# EAGLE design 2019 (EAGLE 9.4.2)

## Sheet 1 of 2
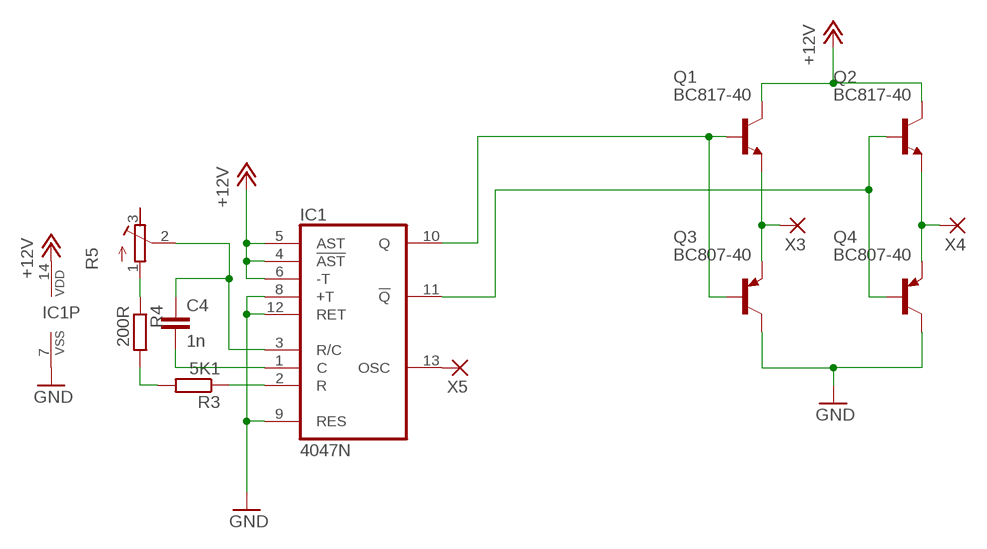
[diagram p0: schematic, sheet 1]

### Parts
C4  1n  CAP_0805  [CAP0805]
IC1  4047N  [DIL14]
Q1  BC817-40  TRANS-NPNSOT-23  [SOT95P240X115-3]
Q2  BC817-40  TRANS-NPNSOT-23  [SOT95P240X115-3]
Q3  BC807-40  TRANS-PNPSOT-23  [SOT95P240X115-3]
Q4  BC807-40  TRANS-PNPSOT-23  [SOT95P240X115-3]
R3  5K1  R_R0805  [RESC2012X50]
R4  200R  R_R0805  [RESC2012X50]
R5  R_POT3296X  [POT-3296X]
X3  WIREPAD-SMD2  [PAD-1.27X2.54]
X4  WIREPAD-SMD2  [PAD-1.27X2.54]
X5  WIREPAD-SMD2  [PAD-1.27X2.54]

### Nets
+12V: IC1.4(!AST) IC1.5(AST) IC1.6(-T) IC1.14(VDD) Q1.3(C) Q2.3(C) ; also sheet 2
GND: IC1.7(VSS) IC1.8(+T) IC1.9(RES) IC1.12(RET) Q3.3(C) Q4.3(C) ; also sheet 2
N$5: C4.1 IC1.3(R/C) R5.2(S)
N$6: C4.2 IC1.1(C)
N$7: IC1.2(R) R3.1
N$8: R3.2 R4.2
N$9: R4.1 R5.1(A)
N$10: IC1.10(Q) Q1.1(B) Q3.1(B)
N$11: IC1.11(!Q) Q2.1(B) Q4.1(B)
N$14: Q1.2(E) Q3.2(E) X3.P$1(P)
N$15: Q2.2(E) Q4.2(E) X4.P$1(P)
N$16: IC1.13(OSC) X5.P$1(P)
Unconnected: R5.3(E)

## Sheet 2 of 2
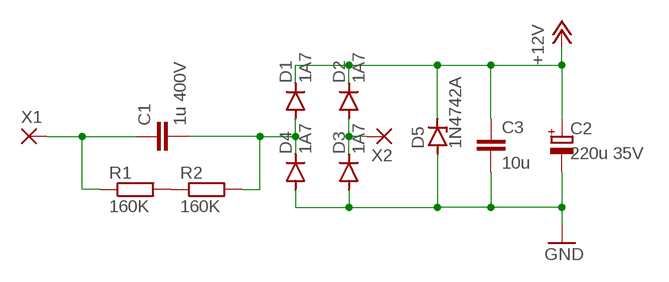
[diagram p1: schematic, sheet 2]

### Parts
C1  1u 400V  C-EU225-108X268  [C225-108X268]
C2  220u 35V  CAP-POL_E2.5-7  [E2,5-7]
C3  10u  CAP_1210  [CAP1210]
D1  1A7  DIODE-D-5  [D-5]
D2  1A7  DIODE-D-5  [D-5]
D3  1A7  DIODE-D-5  [D-5]
D4  1A7  DIODE-D-5  [D-5]
D5  1N4742A  ZENER-DIODEDO41Z10  [DO41Z10]
R1  160K  R_MF-0125  [MF-0125]
R2  160K  R_MF-0125  [MF-0125]
X1  WIREPAD-SMD2  [PAD-1.27X2.54]
X2  WIREPAD-SMD2  [PAD-1.27X2.54]

### Nets
+12V: C2.+ C3.1 D1.C D2.C D5.C ; also sheet 1
GND: C2.- C3.2 D3.A D4.A D5.A ; also sheet 1
N$1: C1.1 R1.1 X1.P$1(P)
N$2: R1.2 R2.1
N$3: C1.2 D1.A D4.C R2.2
N$4: D2.A D3.C X2.P$1(P)

## Library data of the parts
C1 = rcl:C-EU: CAPACITOR, European symbol; SPICEPREFIX: C
C2 = Flamberm:CAP-POL_
C3 C4 = Flamberm:CAP_
D1-D4 = diode:DIODE-: DIODE
D5 = diode:ZENER-DIODE: Z-Diode
IC1 = 40xx:4047: LP monostable/astable MULTIVIBRATOR
Q1 Q2 = Flamberm:TRANS-NPN
Q3 Q4 = Flamberm:TRANS-PNP
R1-R4 = Flamberm:R_
R5 = Flamberm:R_POT
X1-X5 = Flamberm:WIREPAD-SMD2: SMD PAD

## Board
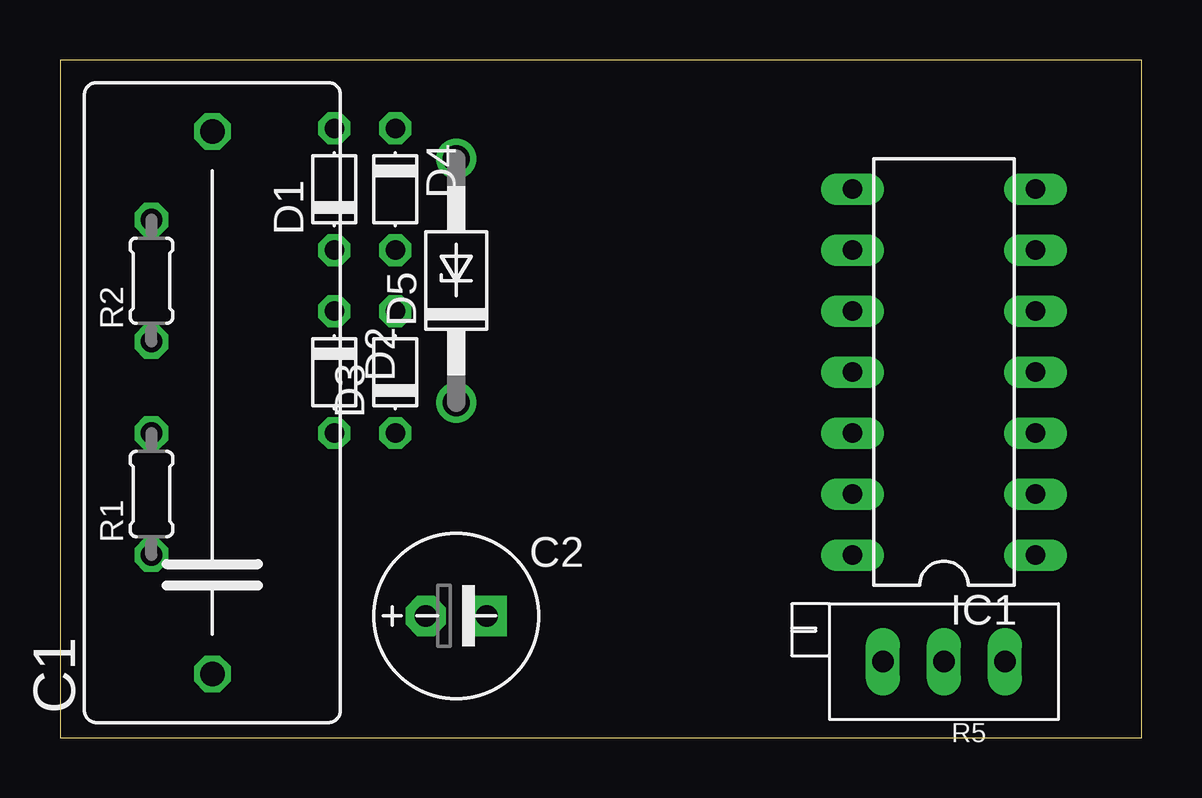
[diagram p2: board, top side]
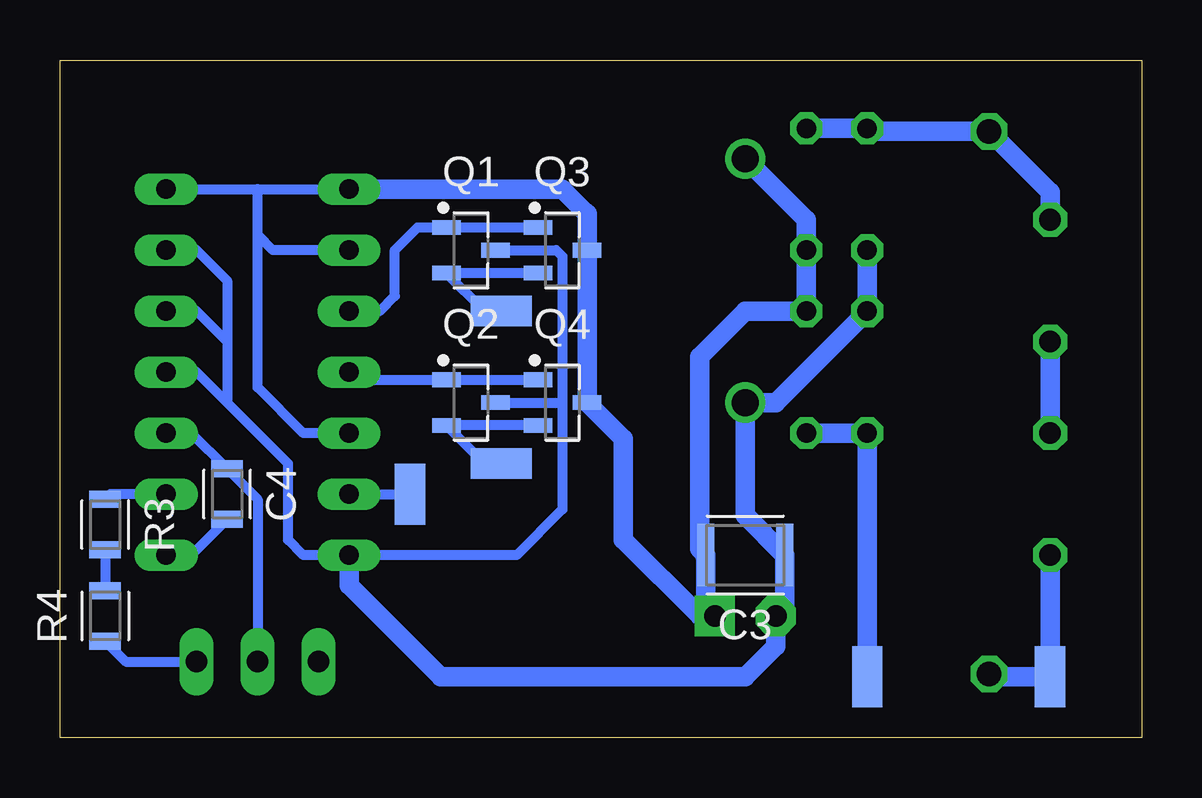
[diagram p3: board, bottom side, seen from below]

Size 45.06 x 28.25 mm. Coordinates in mm from the lower left corner, seen from the top.
Outline: 0,0 45.06,0 45.06,28.25 0,28.25 0,0
Copper layers (1*16): Top 0.035mm / dielectric 1.5mm / Bottom 0.035mm
Design rules "default": minimum track width 6mil, minimum drill 0.35mm, track to track 6mil, track to pad 6mil, pad to pad 6mil, via to via 6mil, smd to smd 6mil, copper to edge 40mil, drill to drill 6mil, minimum pad ring 10mil, minimum via ring 8mil, stop-mask expansion 4mil, vias tented up to drill 0mil, thermal gap 10mil

### Footprints (pad centres in the part's own frame; a part is rotated, then mirrored left to right if it is on the bottom)
C225-108X268 = drill 1.016 octagon: 1 -11.303,0; 2 11.303,0
E2,5-7 = drill 0.9 pad 1.676 octagon: + -1.27,0 | drill 0.9 pad 1.676 square: - 1.27,0
CAP1210 = smd 0.712 x 2.612: 1 -1.65,0; 2 1.65,0
CAP0805 = smd 0.712 x 1.312: 1 -1.05,0; 2 1.05,0
D-5 = drill 0.813 octagon: A 2.54,0; C -2.54,0
DO41Z10 = drill 1.118: A 5.08,0; C -5.08,0
DIL14 = drill 0.813 long: 1 -7.62,-3.81; 2 -5.08,-3.81; 3 -2.54,-3.81; 4 0,-3.81; 5 2.54,-3.81; 6 5.08,-3.81; 7 7.62,-3.81; 8 7.62,3.81; 9 5.08,3.81; 10 2.54,3.81; 11 0,3.81; 12 -2.54,3.81; 13 -5.08,3.81; 14 -7.62,3.81
SOT95P240X115-3 = smd 1.18 x 0.609: 1 -1.024,0.95; 2 -1.024,-0.95; 3 1.024,0
MF-0125 = drill 0.9 octagon: 1 -2.54,0; 2 2.54,0
RESC2012X50 = smd 0.712 x 1.312: 1 -1.05,0; 2 1.05,0
POT-3296X = drill 0.9 long: 1 0,-2.54; 2 0,0; 3 0,2.54
PAD-1.27X2.54 = smd 2.54 x 1.27: P$1 0,0

### Placement (x,y rotation side)
C1  6.35,13.97 90 top
C2  16.51,5.08 0 top
C3  16.51,7.62 180 bottom
C4  38.1,10.16 270 bottom
D1  11.43,22.86 90 top
D2  11.43,15.24 270 top
D3  13.97,15.24 90 top
D4  13.97,22.86 270 top
D5  16.51,19.05 90 top
IC1  36.83,15.24 90 top
Q1  27.94,20.32 0 bottom
Q2  27.94,13.97 0 bottom
Q3  24.13,20.32 0 bottom
Q4  24.13,13.97 0 bottom
R1  3.81,10.16 90 top
R2  3.81,19.05 90 top
R3  43.18,8.89 270 bottom
R4  43.18,5.08 90 bottom
R5  36.83,3.17 90 top
X1  3.81,2.54 270 bottom
X2  11.43,2.54 90 bottom
X3  26.67,17.78 0 bottom
X4  26.67,11.43 0 bottom
X5  30.48,10.16 90 bottom

### Tracks (layer width: path | path; a pad name or v marks a point on that pad's centre or on a via)
+12V
  Bottom 0.406: 38.1,13.97 35.56,11.43 35.56,8.26 34.92,7.62 IC1.14 26.04,7.62 24.13,9.53 24.13,13.97 | 38.1,13.97 39.37,15.24 IC1.4 | IC1.5 39.37,17.78 38.1,16.51 | 38.1,16.51 38.1,13.97 | IC1.6 39.37,20.32 38.1,19.05 38.1,16.51 | Q1.3 24.39,20.32 24.13,20.06 24.13,13.97 | Q2.3 24.13,13.97
  Bottom 0.813: D1.C D2.C 15.24,13.97 D5.C 16.51,9.27 C3.1 14.86,5.46 C2.+ 15.24,3.81 16.51,2.54 29.21,2.54 33.02,6.35 IC1.14
GND
  Bottom 0.406: IC1.7 36.83,22.86 | 36.83,22.86 IC1.8 | IC1.9 36.2,20.32 36.83,20.95 | 36.83,20.95 36.83,22.86 | IC1.12 34.92,12.7 36.83,14.61 36.83,20.95 | 23.11,21.84 23.18,21.91
  Bottom 0.813: D5.A 13.97,21.59 D4.A D3.A 16.51,17.78 18.41,15.88 18.41,7.88 C3.2 18.16,5.46 C2.- 18.41,5.08 21.59,8.26 21.59,12.45 Q4.3 Q3.3 23.11,21.84 | 23.18,21.91 24.13,22.86 IC1.8
N$1
  Bottom 0.813: C1.1 6.22,2.54 X1.P$1 R1.1
N$2
  Bottom 0.813: R1.2 R2.1
N$3
  Bottom 0.813: R2.2 3.81,22.73 C1.2 11.3,25.27 D1.A D4.C
N$4
  Bottom 0.813: X2.P$1 D2.A D3.C
N$5
  Bottom 0.406: IC1.3 39.59,12.7 C4.1 36.83,9.94 R5.2
N$6
  Bottom 0.406: IC1.1 39.59,7.62 C4.2
N$7
  Bottom 0.406: IC1.2 42.96,10.16 R3.1
N$8
  Bottom 0.406: R3.2 R4.2
N$9
  Bottom 0.406: R4.1 42.33,3.17 R5.1
N$10
  Bottom 0.406: Q3.1 Q1.1 30.16,21.27 31.11,20.32 31.11,18.41 31.75,17.78 IC1.10
N$11
  Bottom 0.406: Q4.1 Q2.1 32.7,14.92 IC1.11
N$14
  Bottom 0.406: Q3.2 Q1.2 27.38,17.78 X3.P$1
N$15
  Bottom 0.406: Q4.2 Q2.2 27.38,11.43 X4.P$1
N$16
  Bottom 0.406: IC1.13 X5.P$1